# Altium schematic sheet jetson-orin-baseboard.SchDoc
size 420 x 297 mm
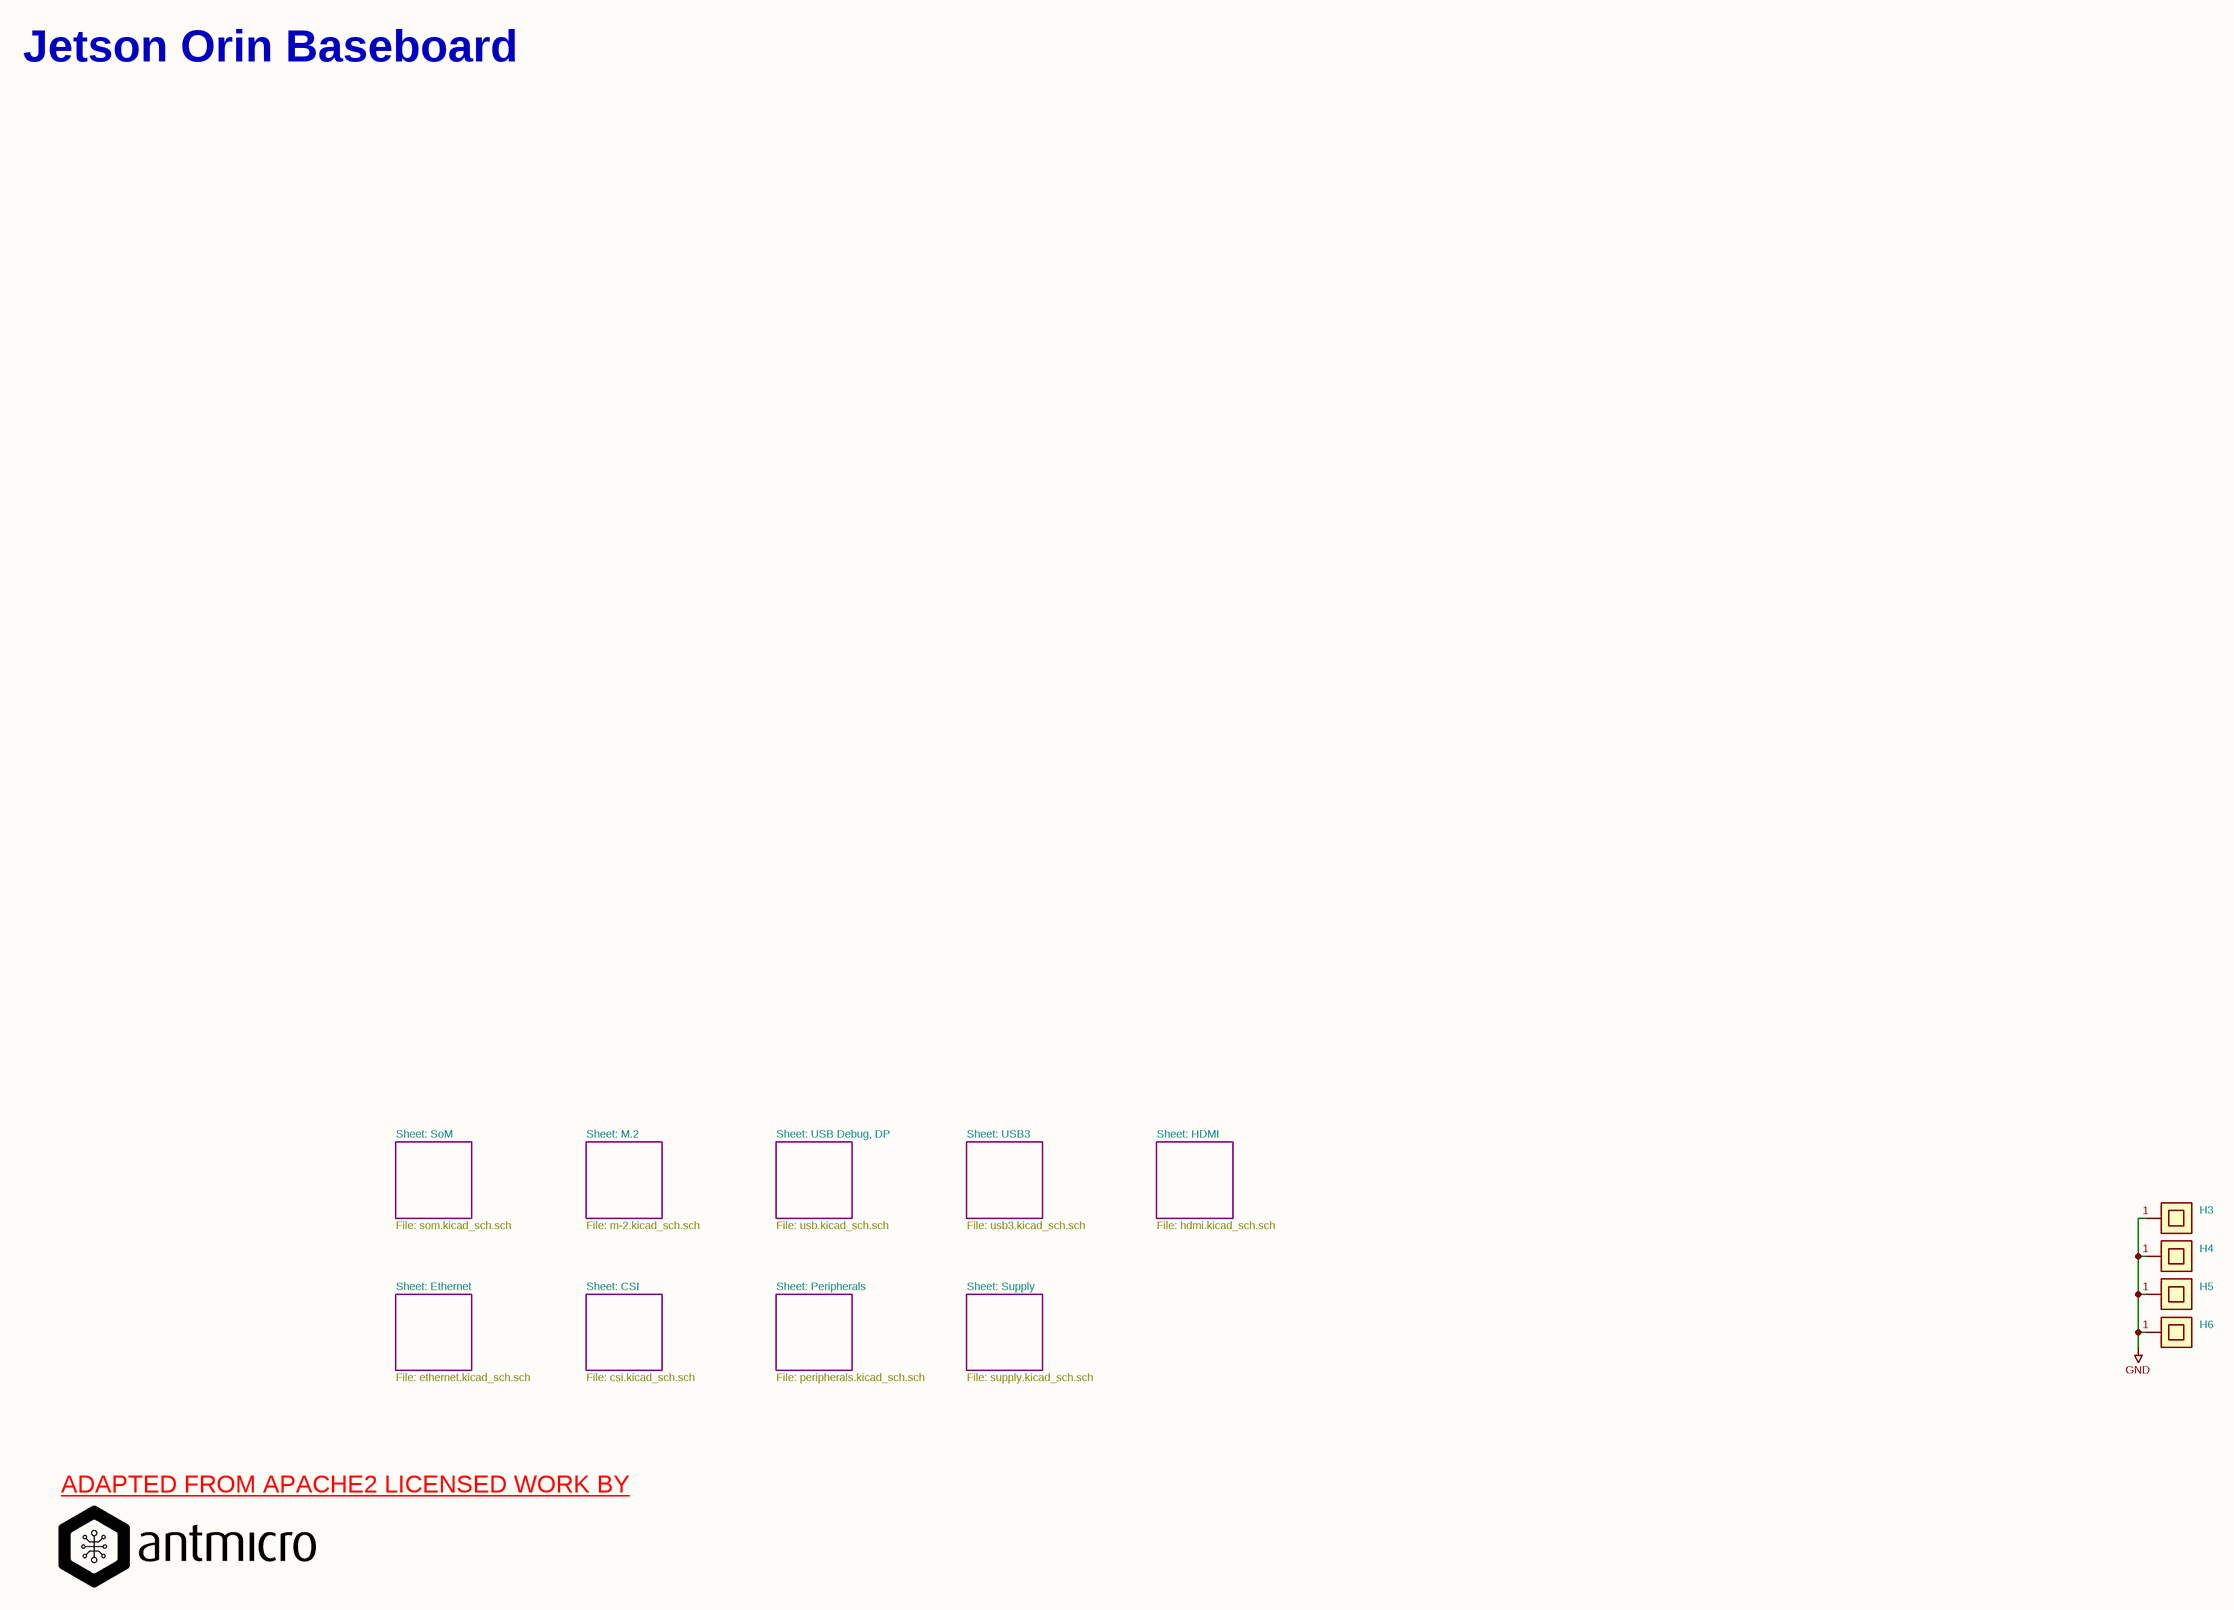
[diagram p0: jetson-orin-baseboard.SchDoc]

## Parts
H3  9774065151R  [Spacer_Drill3.7mm_H6.5mm_9774065151R]  (value not drawn)
H4  9774065151R  [Spacer_Drill3.7mm_H6.5mm_9774065151R]  (value not drawn)
H5  9774065151R  [Spacer_Drill3.7mm_H6.5mm_9774065151R]  (value not drawn)
H6  9774065151R  [Spacer_Drill3.7mm_H6.5mm_9774065151R]  (value not drawn)

## Sub-sheets
CSI = csi.SchDoc: no entries
Ethernet = ethernet.SchDoc: no entries
HDMI = hdmi.SchDoc: no entries
M.2 = m-2.SchDoc: no entries
Peripherals = peripherals.SchDoc: no entries
SoM = som.SchDoc: no entries
Supply = supply.SchDoc: no entries
USB3 = usb3.SchDoc: no entries
USB Debug, DP = usb.SchDoc: no entries

## Nets
GND: H3.1 H4.1 H5.1 H6.1

## Notes on the sheet
- Jetson Orin Baseboard
- Sheet: SoM
- Sheet: M.2
- Sheet: USB Debug, DP
- Sheet: USB3
- Sheet: HDMI
- File: som.kicad_sch.sch
- File: m-2.kicad_sch.sch
- File: usb.kicad_sch.sch
- File: usb3.kicad_sch.sch
- File: hdmi.kicad_sch.sch
- Sheet: Ethernet
- Sheet: CSI
- Sheet: Peripherals
- Sheet: Supply
- File: ethernet.kicad_sch.sch
- File: csi.kicad_sch.sch
- File: peripherals.kicad_sch.sch
- File: supply.kicad_sch.sch
- ADAPTED FROM APACHE2 LICENSED WORK BY <https://github.com/antmicro/jetson-orin-baseboard>
- 1
- 2
- 3
- 4
- 5
- 6
- 7
- 8
- A
- B
- C
- D
- E
- www.antmicro.com <http://www.antmicro.com>
- Title: Jetson Orin Baseboard
- File: jetson-orin-baseboard.kicad_sch
- Sheet: /
- Antmicro Ltd
- F
- KiCad E.D.A.  kicad (5.1.4)-1
- Size: A3
- Date: 2025-01-15
- Rev: 1.3.0
- Id: 1/1

## Library data of the parts
H3-H6 = Spacer_Drill3.7mm_H6.5mm_9774065151R: Manufacturer 1: Würth Elektronik; License: Apache-2.0; Author: Antmicro; OldValue: Spacer_Drill3.7mm_H6.5mm_9774065151R; Manufacturer Part Number 1: 9774065151R; Value: 9774065151R; Footprint: antmicro-footprints:Spacer_Drill3.7mm_H6.5mm_9774065151R